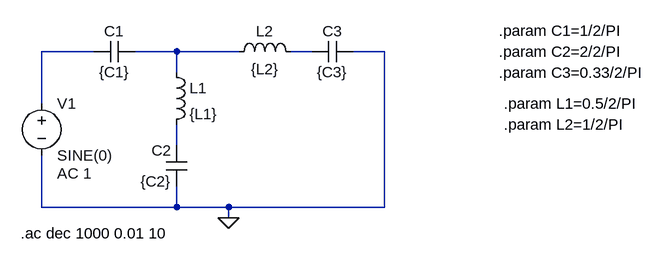
[diagram p0: schematic draft2.asc]
draft2.asc, the LTspice schematic file:
Version 4
SHEET 1 880 680
WIRE -48 0 -128 0
WIRE 80 0 16 0
WIRE 176 0 80 0
WIRE 288 0 256 0
WIRE 400 0 352 0
WIRE 80 32 80 0
WIRE -128 80 -128 0
WIRE 80 144 80 112
WIRE -128 240 -128 160
WIRE 80 240 80 208
WIRE 80 240 -128 240
WIRE 160 240 80 240
WIRE 400 240 400 0
WIRE 400 240 160 240
WIRE 160 256 160 240
FLAG 160 256 0
SYMBOL cap 16 -16 R90
WINDOW 0 0 32 VBottom 2
WINDOW 3 32 32 VTop 2
SYMATTR InstName C1
SYMATTR Value {C1}
SYMBOL cap 96 208 R180
WINDOW 0 24 56 Left 2
WINDOW 3 24 8 Left 2
SYMATTR InstName C2
SYMATTR Value {C2}
SYMBOL ind 64 16 R0
SYMATTR InstName L1
SYMATTR Value {L1}
SYMBOL voltage -128 64 R0
WINDOW 123 24 124 Left 2
WINDOW 39 0 0 Left 0
SYMATTR Value2 AC 1
SYMATTR InstName V1
SYMATTR Value SINE(0)
SYMBOL ind 160 16 R270
WINDOW 0 32 56 VTop 2
WINDOW 3 5 56 VBottom 2
SYMATTR InstName L2
SYMATTR Value {L2}
SYMBOL cap 352 -16 R90
WINDOW 0 0 32 VBottom 2
WINDOW 3 32 32 VTop 2
SYMATTR InstName C3
SYMATTR Value {C3}
TEXT -160 280 Left 2 !.ac dec 1000 0.01 10
TEXT 576 -32 Left 2 !.param C1=1/2/PI
TEXT 576 0 Left 2 !.param C2=2/2/PI
TEXT 576 32 Left 2 !.param C3=0.33/2/PI
TEXT 584 80 Left 2 !.param L1=0.5/2/PI
TEXT 584 112 Left 2 !.param L2=1/2/PI

The netlist it stands for:
* draft2.asc
C1 N002 N001 {C1}
C2 0 N004 {C2}
L1 N002 N004 {L1}
V1 N001 0 SINE(0) AC 1
L2 N002 N003 {L2}
C3 0 N003 {C3}
.ac dec 1000 0.01 10
.param C1=1/2/PI
.param C2=2/2/PI
.param C3=0.33/2/PI
.param L1=0.5/2/PI
.param L2=1/2/PI
.backanno
.end